# Altium schematic sheet MAXIMRS232.SchDoc
size A4
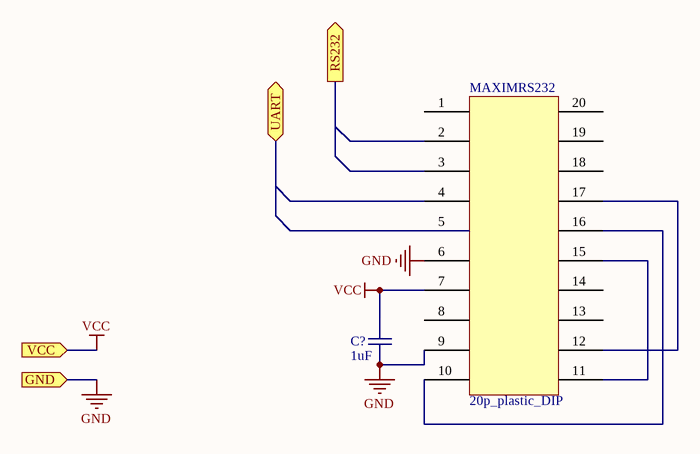
[diagram p0: MAXIMRS232.SchDoc]

## Parts
C?  1uF  [CAPC0603(1608)55_N]
MAXIMRS232  20p_plastic_DIP  [20p_plastic_DIP]

## Ports
GND (in), RS232 (out), UART, VCC (in)

## Nets
GND: C?.1 ; port GND
VCC: C?.2 ; port VCC
NetMAXIMRS232_11: MAXIMRS232.11 MAXIMRS232.15
NetMAXIMRS232_12: MAXIMRS232.12 MAXIMRS232.17

Not connected (* = marked no-connect by the designer): MAXIMRS232 1 2 3 4 5 6 7 8 9 10 13 14 16 18 19 20

## Notes on the sheet
- Labels drawn without touching a wire or pin: GND

## Library data of the parts
C? = 3934: Capacitor; id: 3934; pakke_opprettet_av: 815; navn: 220nF; pris: 0; nokkelord: kondensator; pakketype: 0603; pakke_opprettet: 18.02.2015 14:18:13; symbol_opprettet_av: 815; symbol_opprettet: 14.11.2014 20:19:34